# Altium schematic sheet IS12.01-01.603.01.SchDoc
size 750 x 449 mm; SheetNumber: 1; SheetTotal: 1
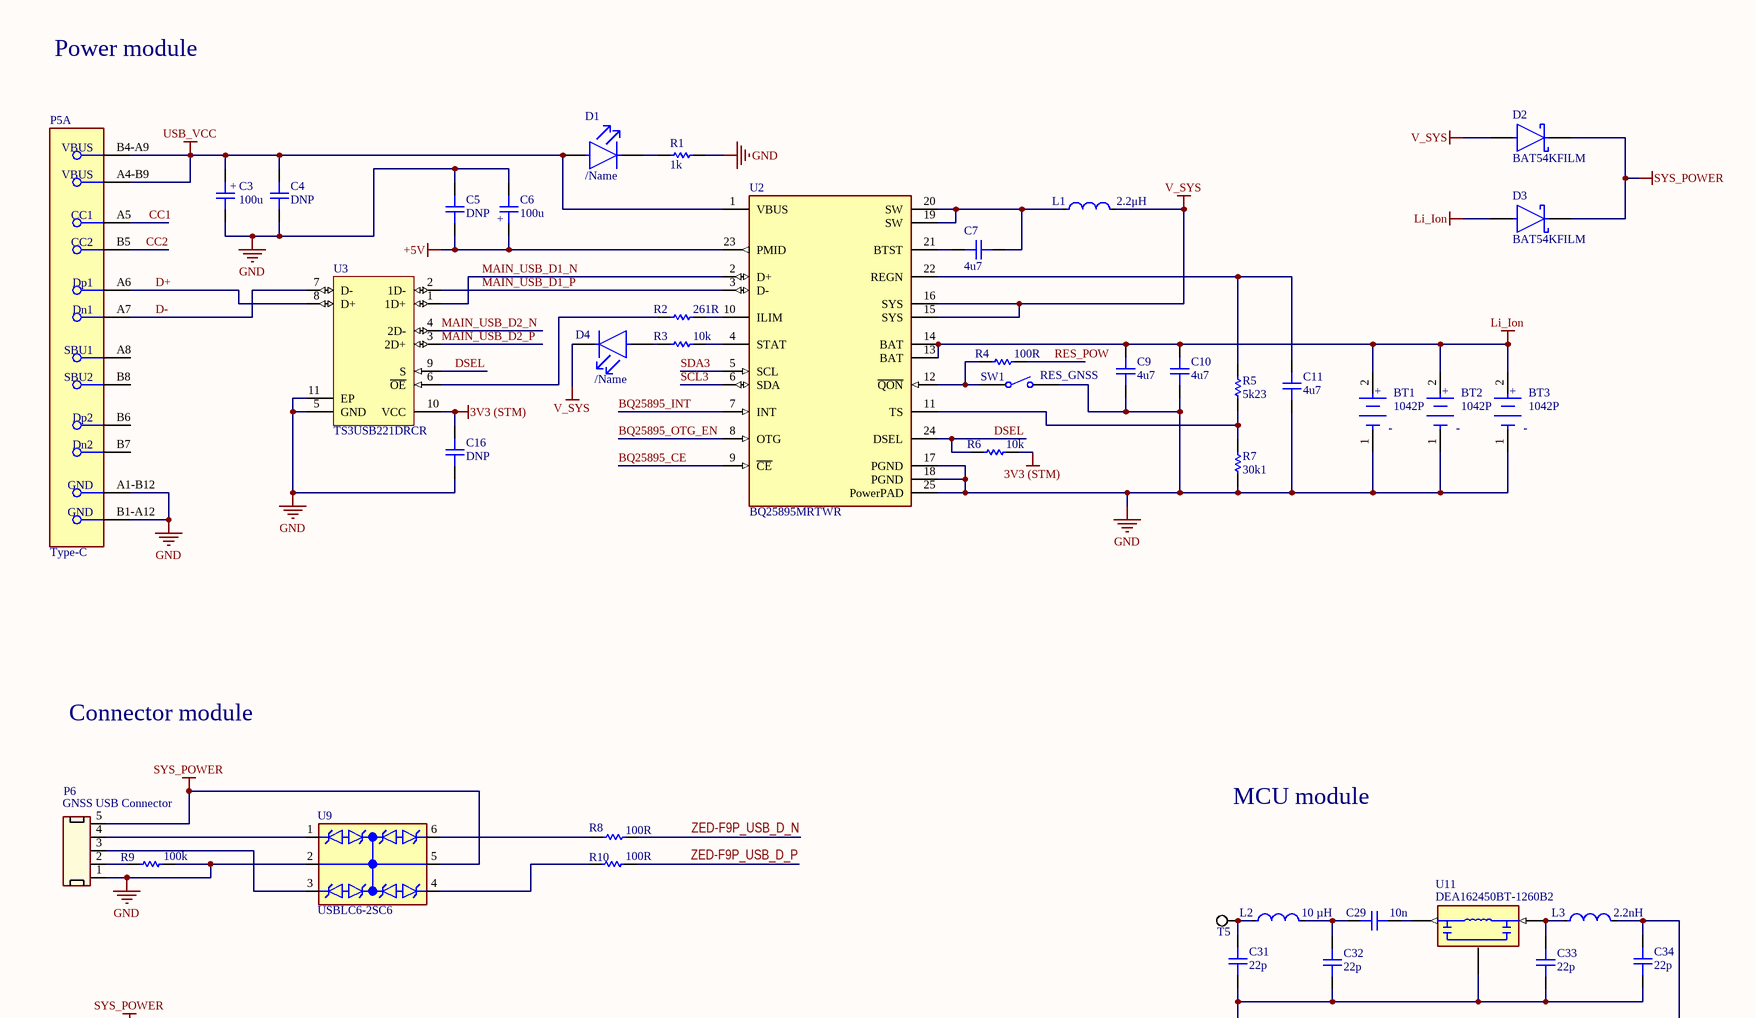
[diagram p0: IS12.01-01.603.01.SchDoc, top left]
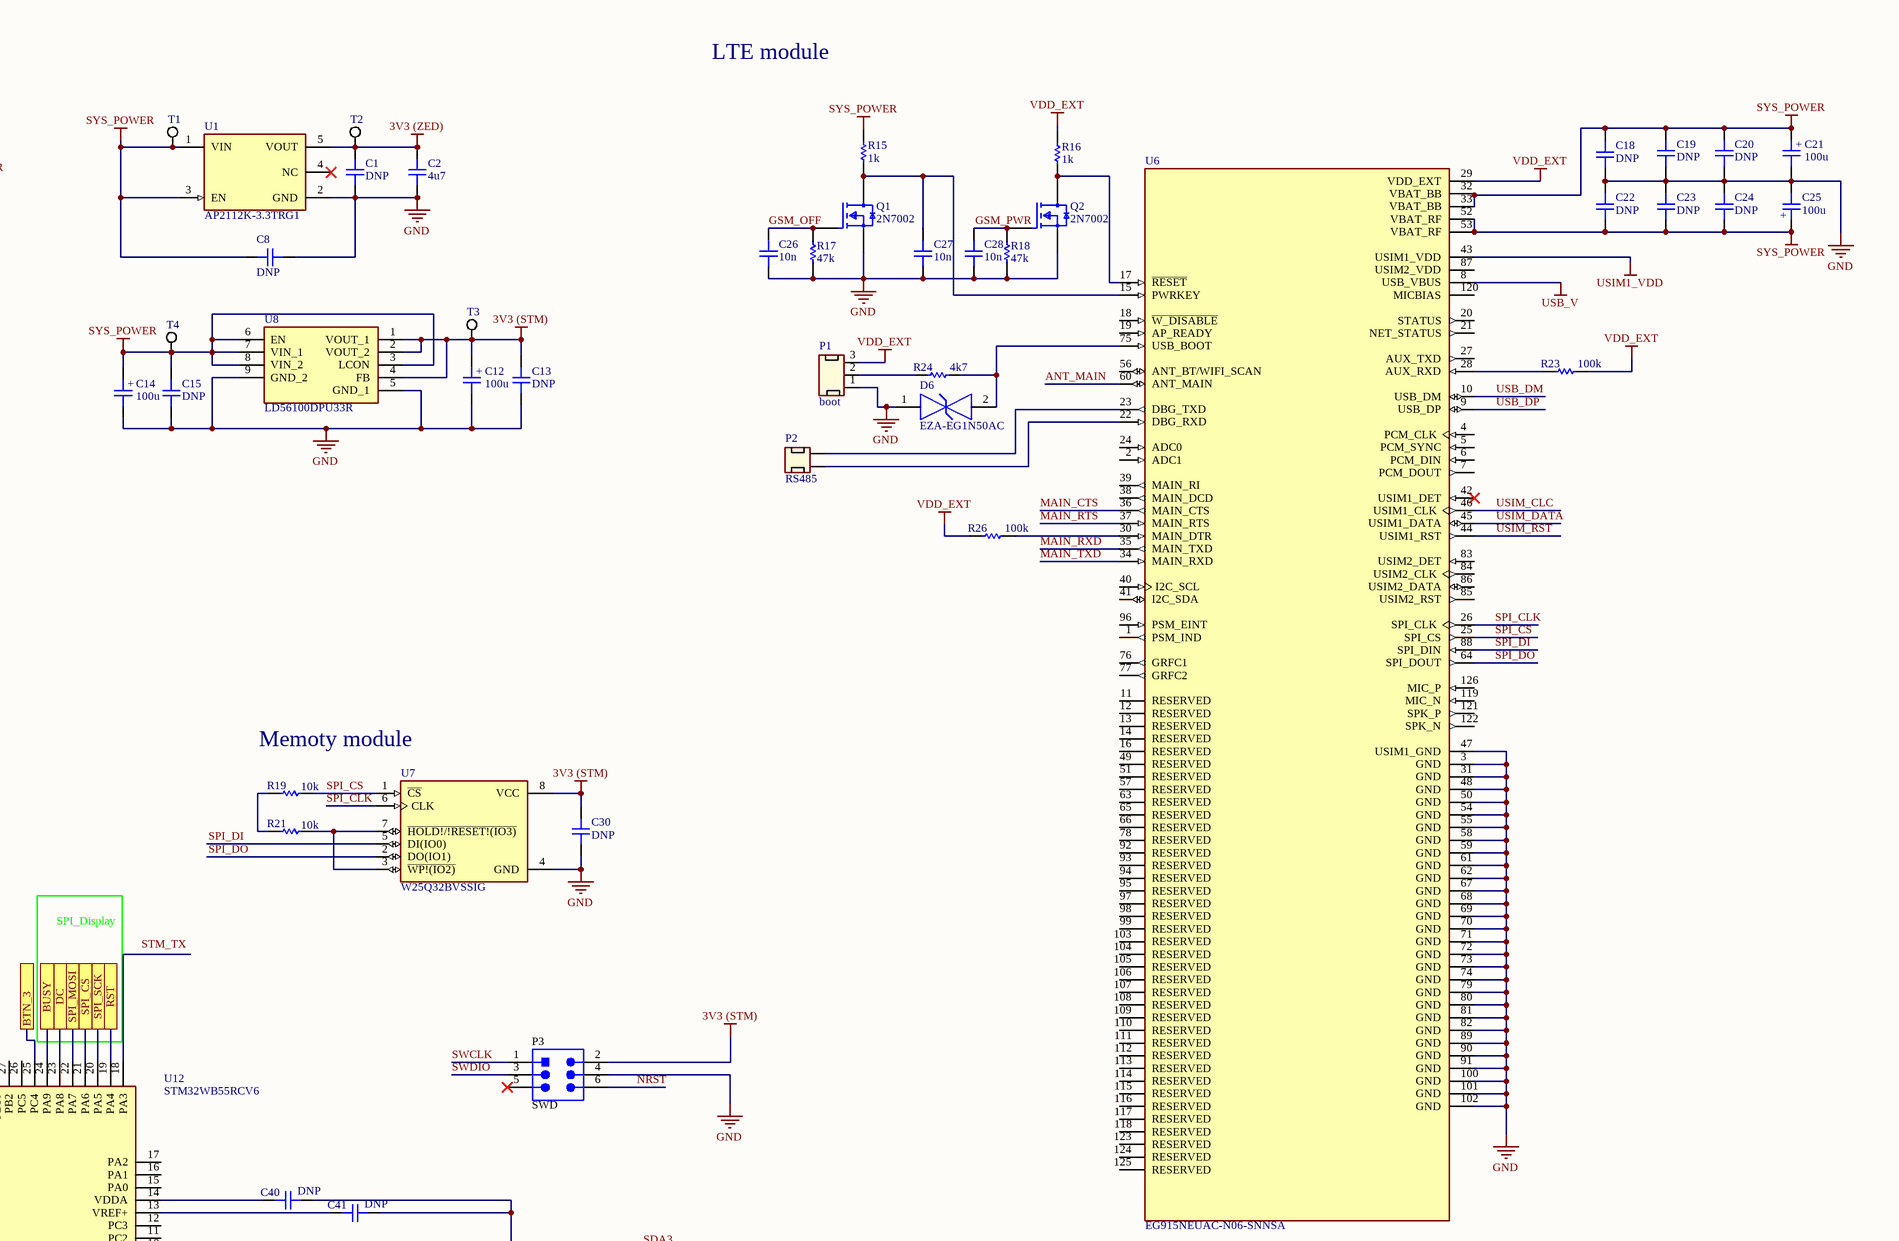
[diagram p1: IS12.01-01.603.01.SchDoc, top right]
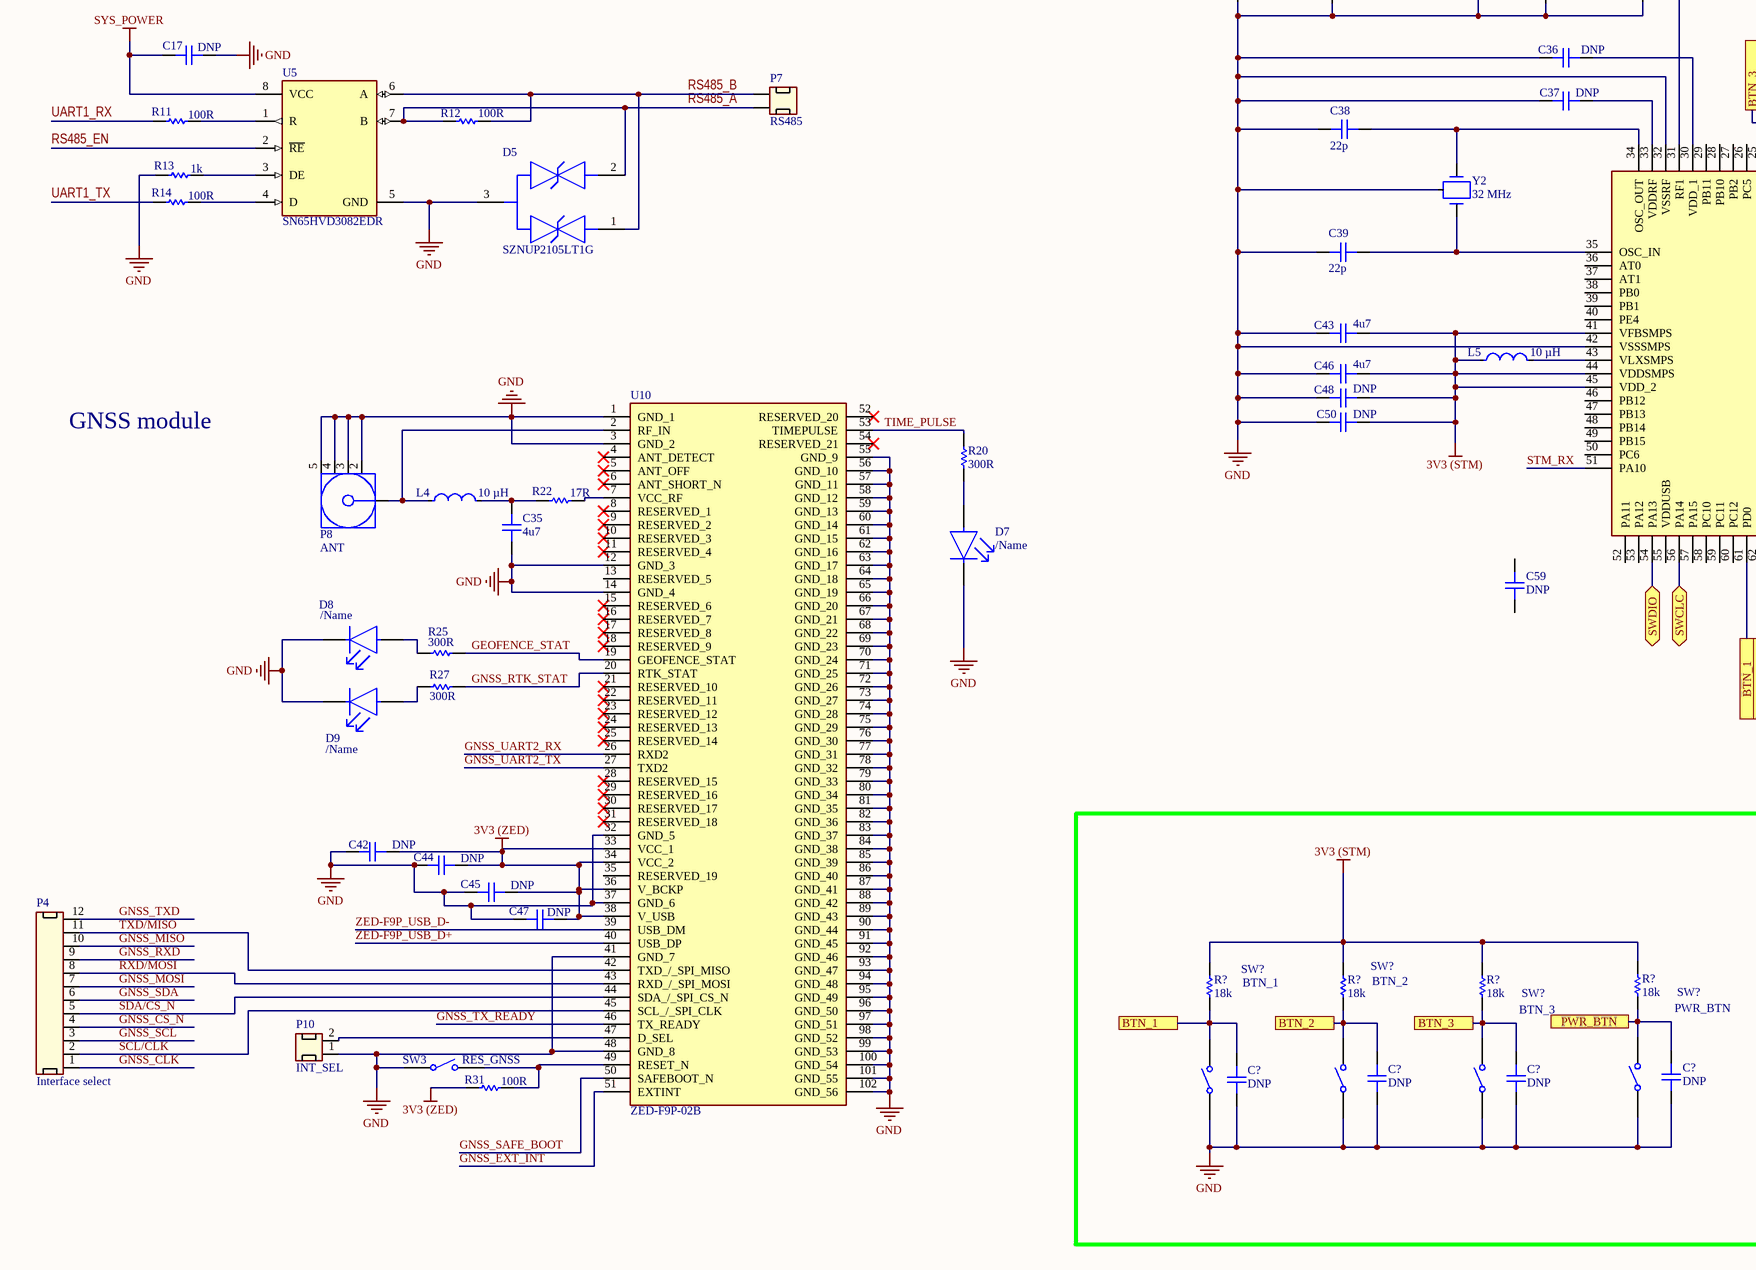
[diagram p2: IS12.01-01.603.01.SchDoc, bottom left]
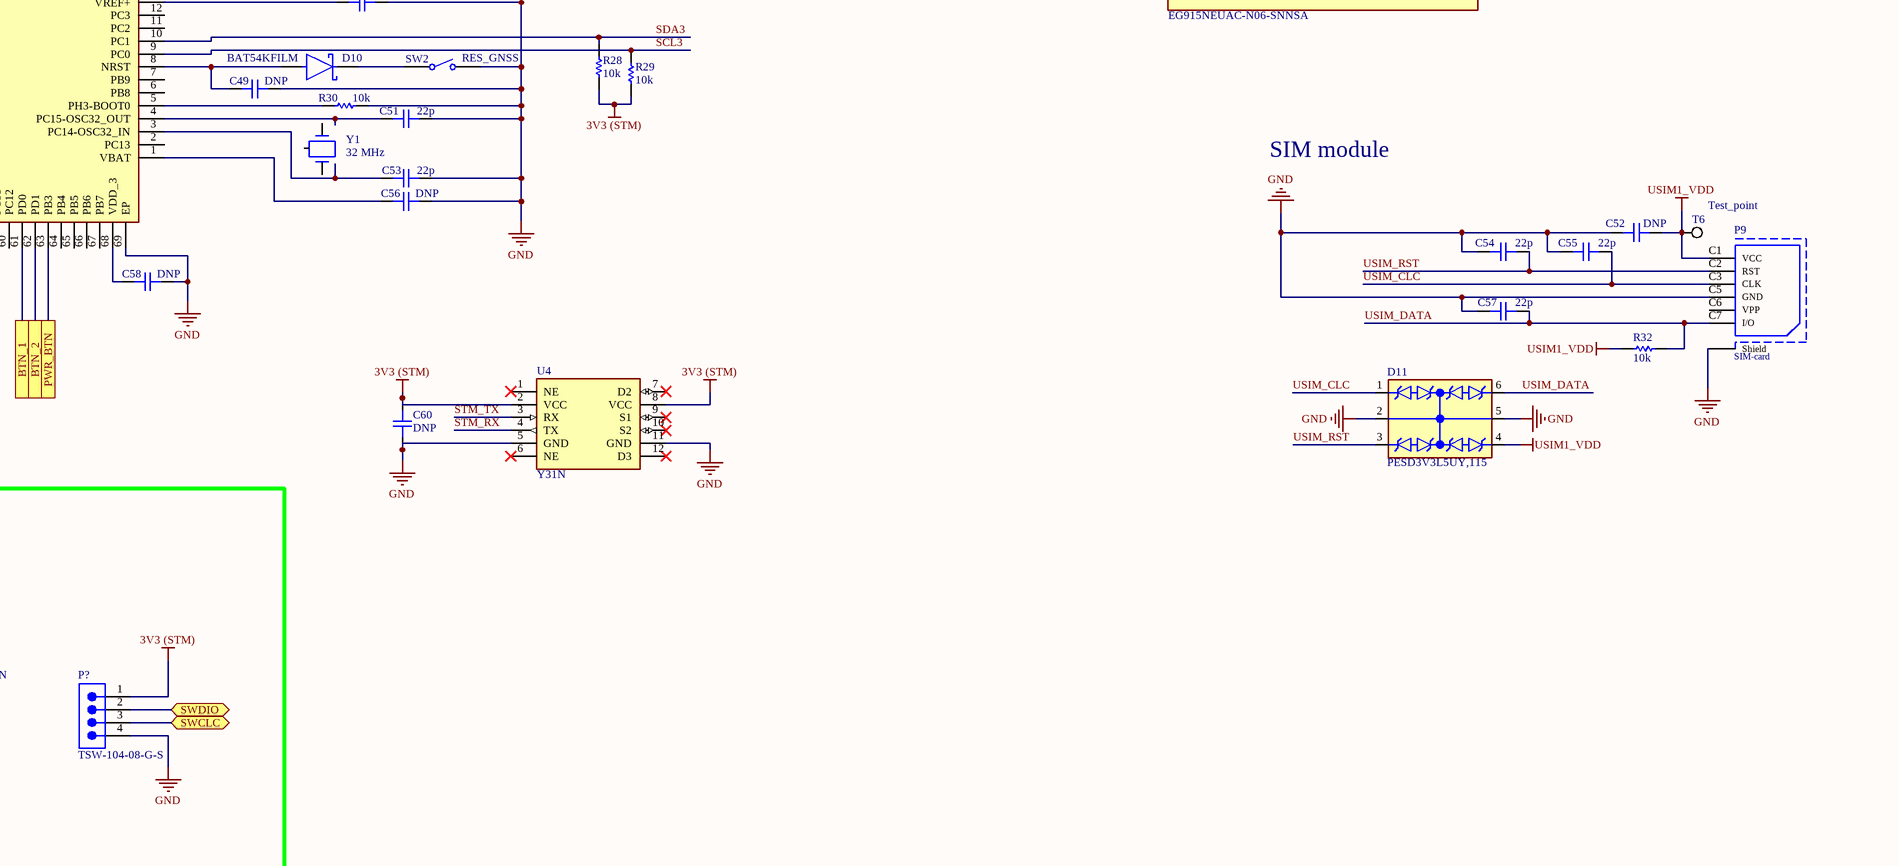
[diagram p3: IS12.01-01.603.01.SchDoc, bottom right]

## Parts
(Parts that share a designator on the sheet are numbered #1, #2 ... from top to bottom, then left to right.)
BT1  1042P  [FP-1042P-MFG]
BT2  1042P  [FP-1042P-MFG]
BT3  1042P  [FP-1042P-MFG]
C1  DNP  [C-0603]
C2  4u7  [C-0603]
C3  100u  [A-TANTAL-A]
C4  DNP  [C-0603]
C5  DNP  [C-0603]
C6  100u  [A-TANTAL-A]
C7  4u7  [C-0603]
C8  DNP  [C-0603]
C9  4u7  [C-0603]
C10  4u7  [C-0603]
C11  4u7  [C-0603]
C12  100u  [A-TANTAL-A]
C13  DNP  [C-0603]
C14  100u  [A-TANTAL-A]
C15  DNP  [C-0603]
C16  DNP  [C-0603]
C17  DNP  [C-0603]
C18  DNP  [C-0603]
C19  DNP  [C-0603]
C20  DNP  [C-0603]
C21  100u  [A-TANTAL-A]
C22  DNP  [C-0603]
C23  DNP  [C-0603]
C24  DNP  [C-0603]
C25  100u  [A-TANTAL-A]
C26  10n  [C-0603]
C27  10n  [C-0603]
C28  10n  [C-0603]
C29  10n  [C-0603]
C30  DNP  [C-0603]
C31  22p  [C-0603]
C32  22p  [C-0603]
C33  22p  [C-0603]
C34  22p  [C-0603]
C35  4u7  [C-0603]
C36  DNP  [C-0603]
C37  DNP  [C-0603]
C38  22p  [C-0603]
C39  22p  [C-0603]
C40  DNP  [C-0603]
C41  DNP  [C-0603]
C42  DNP  [C-0603]
C43  4u7  [C-0603]
C44  DNP  [C-0603]
C45  DNP  [C-0603]
C46  4u7  [C-0603]
C47  DNP  [C-0603]
C48  DNP  [C-0603]
C49  DNP  [C-0603]
C50  DNP  [C-0603]
C51  22p  [C-0603]
C52  DNP  [C-0603]
C53  22p  [C-0603]
C54  22p  [C-0603]
C55  22p  [C-0603]
C56  DNP  [C-0603]
C57  22p  [C-0603]
C58  DNP  [C-0603]
C59  DNP  [C-0603]
C60  DNP  [C-0603]
C?#1  DNP  [C-0603]
C?#2  DNP  [C-0603]
C?#3  DNP  [C-0603]
C?#4  DNP  [C-0603]
D1  /Name  [FP-LTST-C191TBKT-MFG]
D2  BAT54KFILM  [SOD-523]
D3  BAT54KFILM  [SOD-523]
D4  /Name  [FP-LTST-C191TBKT-MFG]
D5  SZNUP2105LT1G  [FP-Micro3-IPC_B]
D6  EZA-EG1N50AC  [FP-EZAEG1-MFG]
D7  /Name  [FP-LTST-C191TBKT-MFG]
D8  /Name  [FP-LTST-C191TBKT-MFG]
D9  /Name  [FP-LTST-C191TBKT-MFG]
D10  BAT54KFILM  [SOD-523]
D11  PESD3V3L5UY,115  [SOT95P280X145-6N]
L1  2.2μH  [FP-NR6028-MFG]
L2  10 µH  [FP-MLZ1608-IPC_A]
L3  2.2nH  [FP-NR6028-MFG]
L4  10 µH  [FP-MLZ1608-IPC_A]
L5  10 µH  [FP-MLZ1608-IPC_A]
P1  boot  [PLS-3]
P2  RS485  [PLS-2]
P3  SWD  [SMTC-TSW-103-08-L-D_V]
P4  Interface select  [PLS-12]
P5  Type-C  [FP-217179-0001-MFG]  (part A of 2)
P6  GNSS USB Connector  [PLS-5]
P7  RS485  [PLS-2]
P8  ANT  [FP-142-0701-201-MFG]
P9  SIM-card  [693043020611]
P10  INT_SEL  [PLS-2]
P?  TSW-104-08-G-S  [SMTC-TSW-104-08-X-S]
Q1  2N7002  [FP-Micro3-IPC_B]
Q2  2N7002  [FP-Micro3-IPC_B]
R1  1k  [R-0603]
R2  261R  [R-0603]
R3  10k  [R-0603]
R4  100R  [R-0603]
R5  5k23  [R-0603]
R6  10k  [R-0603]
R7  30k1  [R-0603]
R8  100R  [R-0603]
R9  100k  [R-0603]
R10  100R  [R-0603]
R11  100R  [R-0603]
R12  100R  [R-0603]
R13  1k  [R-0603]
R14  100R  [R-0603]
R15  1k  [R-0603]
R16  1k  [R-0603]
R17  47k  [R-0603]
R18  47k  [R-0603]
R19  10k  [R-0603]
R20  300R  [R-0603]
R21  10k  [R-0603]
R22  17R  [R-0603]
R23  100k  [R-0603]
R24  4k7  [R-0603]
R25  300R  [R-0603]
R26  100k  [R-0603]
R27  300R  [R-0603]
R28  10k  [R-0603]
R29  10k  [R-0603]
R30  10k  [R-0603]
R31  100R  [R-0603]
R32  10k  [R-0603]
R?#1  18k  [R-0603]
R?#2  18k  [R-0603]
R?#3  18k  [R-0603]
R?#4  18k  [R-0603]
SW1  RES_GNSS  [TECO-FSMSMTR_V]
SW2  RES_GNSS  [TECO-FSMSMTR_V]
SW3  RES_GNSS  [TECO-FSMSMTR_V]
SW?#1  BTN_1  [TECO-FSMSMTR_V]
SW?#2  BTN_2  [TECO-FSMSMTR_V]
SW?#3  BTN_3  [TECO-FSMSMTR_V]
SW?#4  PWR_BTN  [TECO-FSMSMTR_V]
T1  Test_point  [test_point]  (value not drawn)
T2  Test_point  [test_point]  (value not drawn)
T3  Test_point  [test_point]  (value not drawn)
T4  Test_point  [test_point]  (value not drawn)
T5  Test_point  [test_point]  (value not drawn)
T6  Test_point  [test_point]
U1  AP2112K-3.3TRG1  [SOT95P285X140-5N]
U2  BQ25895MRTWR  [QFN50P400X400X80-25N]
U3  TS3USB221DRCR  [SON50P300X300X100-11N]
U4  Y31N  [Y31N]
U5  SN65HVD3082EDR  [FP-SO-8-MFG]
U6  EG915NEUAC-N06-SNNSA  [XCVR_EG915NEUAC-N06-SNNSA]
U7  W25Q32BVSSIG  [SOIC127P790X216-8N]
U8  LD56100DPU33R  [LD56100DPU33R]
U9  USBLC6-2SC6  [SOT95P280X145-6N]
U10  ZED-F9P-02B  [ZEDF9P02B]
U11  DEA162450BT-1260B2  [FIL_DEA162450BT-1288B1]
U12  STM32WB55RCV6  [QFN40P800X800X100-69N-D]
Y1  32 MHz  [SMD-4 (4.5x3.2)]
Y2  32 MHz  [SMD-4 (4.5x3.2)]

## Ports
BTN_1, BTN_2, BTN_3, BUSY, DC, PWR_BTN, RST, SPI_CS, SPI_MOSI, SPI_SCK, SWCLC (bidir), SWDIO (bidir)

## Nets
3V3 (STM): C12.1 C13.1 C16.2 C30.2 C43.2 C46.2 C48.2 C50.2 C60.1 L5.1 P3.2 P?.1 R6.2 R28.1 R29.1 R?#1.2 R?#2.2 R?#3.2 R?#4.2 T3.1 U3.10(VCC) U4.2(VCC) U4.8(VCC) U7.8(VCC) U8.1(VOUT_1) U8.2(VOUT_2) U8.4(FB) U12.41(VFBSMPS) U12.44(VDDSMPS) U12.45(VDD_2)
3V3 (ZED): C1.2 C2.2 C42.1 C44.1 C45.1 C47.1 R31.1 T2.1 U1.5(VOUT) U10.33(VCC_1) U10.34(VCC_2) U10.36(V_BCKP) U10.38(V_USB)
+5V: C5.2 C6.1 U2.23(PMID)
GND: BT1.1(C) BT2.1(C) BT3.1(C) C1.1 C2.1 C3.2 C4.1 C5.1 C6.2 C8.2 C9.1 C10.1 C11.1 C12.2 C13.2 C14.2 C15.2 C16.1 C17.1 C18.1 C19.1 C20.1 C21.2 C22.2 C23.2 C24.2 C25.2 C26.1 C27.1 C28.1 C30.1 C31.2 C32.2 C33.2 C34.2 C35.2 C36.2 C37.1 C38.1 C39.1 C40.2 C41.2 C42.2 C43.1 C44.2 C45.2 C46.1 C47.2 C48.1 C49.2 C50.1 C51.2 C52.2 C53.2 C54.1 C55.1 C56.2 C57.1 C58.2 C60.2 C?#1.2 C?#2.2 C?#3.2 C?#4.2 D5.3 D6.1 D7.1(C) D8.1(C) D9.1(C) D11.2(CC1) D11.5(CC2) P1.1 P3.4 P5.A1-B12(GND) P5.B1-A12(GND) P6.1 P8.2 P8.3 P8.4 P8.5 P9.C5(GND) P9.Shield P10.1 P?.4 Q1.2(S) Q2.2(S) R1.1 R7.1 R9.2 R13.1 R17.1 R18.1 R30.1 SW1.2 SW2.2 SW3.1 SW?#1.1 SW?#2.1 SW?#3.1 SW?#4.1 U1.2(GND) U2.17(PGND) U2.18(PGND) U2.25(PowerPAD) U3.5(GND) U3.11(EP) U4.5(GND) U4.11(GND) U5.5(GND) U6.3(GND) U6.31(GND) U6.47(USIM1_GND) U6.48(GND) U6.50(GND) U6.54(GND) U6.55(GND) U6.58(GND) U6.59(GND) U6.61(GND) U6.62(GND) U6.67(GND) U6.68(GND) U6.69(GND) U6.70(GND) U6.71(GND) U6.72(GND) U6.73(GND) U6.74(GND) U6.79(GND) U6.80(GND) U6.81(GND) U6.82(GND) U6.89(GND) U6.90(GND) U6.91(GND) U6.100(GND) U6.101(GND) U6.102(GND) U7.4(GND) U8.5(GND_1) U8.9(GND_2) U9.2(CC1) U10.1(GND_1) U10.3(GND_2) U10.12(GND_3) U10.14(GND_4) U10.32(GND_5) U10.37(GND_6) U10.41(GND_7) U10.48(GND_8) U10.55(GND_9) U10.56(GND_10) U10.57(GND_11) U10.58(GND_12) U10.59(GND_13) U10.60(GND_14) U10.61(GND_15) U10.62(GND_16) U10.63(GND_17) U10.64(GND_18) U10.65(GND_19) U10.66(GND_20) U10.67(GND_21) U10.68(GND_22) U10.69(GND_23) U10.70(GND_24) U10.71(GND_25) U10.72(GND_26) U10.73(GND_27) U10.74(GND_28) U10.75(GND_29) U10.76(GND_30) U10.77(GND_31) U10.78(GND_32) U10.79(GND_33) U10.80(GND_34) U10.81(GND_35) U10.82(GND_36) U10.83(GND_37) U10.84(GND_38) U10.85(GND_39) U10.86(GND_40) U10.87(GND_41) U10.88(GND_42) U10.89(GND_43) U10.90(GND_44) U10.91(GND_45) U10.92(GND_46) U10.93(GND_47) U10.94(GND_48) U10.95(GND_49) U10.96(GND_50) U10.97(GND_51) U10.98(GND_52) U10.99(GND_53) U10.100(GND_54) U10.101(GND_55) U10.102(GND_56) U11.2(GND) U12.32(VSSRF) U12.42(VSSSMPS) U12.69(EP) Y2.3
Li_Ion: BT1.2(A) BT2.2(A) BT3.2(A) C9.2 C10.2 D3.2(A) U2.13(BAT) U2.14(BAT)
SYS_POWER: C8.1 C14.1 C15.1 C17.2 C18.2 C19.2 C20.2 C21.1 C22.1 C23.1 C24.1 C25.1 D2.1(C) D3.1(C) P6.5 R15.2 T1.1 T4.1 U1.1(VIN) U1.3(EN) U5.8(VCC) U6.32(VBAT_BB) U6.33(VBAT_BB) U6.52(VBAT_RF) U6.53(VBAT_RF) U8.3(LCON) U8.6(EN) U8.7(VIN_1) U8.8(VIN_2) U9.5(CC2)
USB_V: U6.8(USB_VBUS)
USB_VCC: C3.1 C4.2 D1.2(A) P5.A4-B9(VBUS) P5.B4-A9(VBUS) U2.1(VBUS)
USIM1_VDD: C52.1 D11.4(C3) P9.C1(VCC) R32.1 T6.1 U6.43(USIM1_VDD)
V_SYS: D2.2(A) D4.1(C) L1.2 U2.15(SYS) U2.16(SYS)
VDD_EXT: P1.3 R16.2 R23.1 R26.2 U6.29(VDD_EXT)
ANT_MAIN: U6.60(ANT_MAIN)
BQ25895_CE: U2.9(~{CE})
BQ25895_INT: U2.7(INT)
BQ25895_OTG_EN: U2.8(OTG)
BTN_1: C?#1.1 R?#1.1 SW?#1.2 U12.61(PD0) ; port BTN_1
BTN_2: C?#2.1 R?#2.1 SW?#2.2 U12.62(PD1) ; port BTN_2
BTN_3: C?#3.1 R?#3.1 SW?#3.2 U12.25(PC4) ; port BTN_3
BUSY: U12.24(PA9) ; port BUSY
CC1: P5.A5(CC1)
CC2: P5.B5(CC2)
D+: P5.A6(Dp1) U3.8(D+)
D-: P5.A7(Dn1) U3.7(D-)
DC: U12.23(PA8) ; port DC
DSEL: R6.1 U2.24(DSEL) U3.9(S)
GEOFENCE_STAT: R25.2 U10.19(GEOFENCE_STAT)
GNSS_CLK: P4.1
GNSS_CS_N: P4.4
GNSS_EXT_INT: U10.51(EXTINT)
GNSS_MISO: P4.10
GNSS_MOSI: P4.7
GNSS_RTK_STAT: R27.2 U10.20(RTK_STAT)
GNSS_RXD: P4.9
GNSS_SAFE_BOOT: U10.50(SAFEBOOT_N)
GNSS_SCL: P4.3
GNSS_SDA: P4.6
GNSS_TX_READY: U10.46(TX_READY)
GNSS_TXD: P4.12
GNSS_UART2_RX: U10.26(RXD2)
GNSS_UART2_TX: U10.27(TXD2)
GSM_OFF: C26.2 Q1.1(G) R17.2
GSM_PWR: C28.2 Q2.1(G) R18.2
MAIN_CTS: U6.36(MAIN_CTS)
MAIN_RTS: U6.37(MAIN_RTS)
MAIN_RXD: U6.35(MAIN_TXD)
MAIN_TXD: U6.34(MAIN_RXD)
MAIN_USB_D1_N: U2.2(D+) U3.1(1D+)
MAIN_USB_D1_P: U2.3(D-) U3.2(1D-)
MAIN_USB_D2_N: U3.4(2D-)
MAIN_USB_D2_P: U3.3(2D+)
NRST: P3.6
PWR_BTN: C?#4.1 R?#4.1 SW?#4.2 U12.63(PB3) ; port PWR_BTN
RES_POW: R4.2
RS485_A: D5.2 P7.2 R12.1 U5.7(B)
RS485_B: D5.1 P7.1 R12.2 U5.6(A)
RS485_EN: U5.2(~{RE})
RST: U12.19(PA4) ; port RST
RXD/MOSI: P4.8 U10.43(RXD_/_SPI_MOSI)
SCL3: R29.2 U2.6(SDA) U12.9(PC0)
SCL/CLK: P4.2 U10.45(SCL_/_SPI_CLK)
SDA3: R28.2 U2.5(SCL) U12.10(PC1)
SDA/CS_N: P4.5 U10.44(SDA_/_SPI_CS_N)
SPI_CLK: U6.26(SPI_CLK) U7.6(CLK)
SPI_CS: R19.2 U6.25(SPI_CS) U7.1(~{CS})
SPI_CS: U12.21(PA6) ; port SPI_CS  [a separate net that carries the same name]
SPI_DI: U6.88(SPI_DIN) U7.5(DI(IO0))
SPI_DO: U6.64(SPI_DOUT) U7.2(DO(IO1))
SPI_MOSI: U12.22(PA7) ; port SPI_MOSI
SPI_SCK: U12.20(PA5) ; port SPI_SCK
STM_RX: U4.4(TX) U12.51(PA10)
STM_TX: U4.3(RX)
SWCLC: P?.3 U12.56(PA14) ; port SWCLC
SWCLK: P3.1
SWDIO: P3.3
SWDIO: P?.2 U12.54(PA13) ; port SWDIO  [a separate net that carries the same name]
TIME_PULSE: R20.2 U10.53(TIMEPULSE)
TXD/MISO: P4.11 U10.42(TXD_/_SPI_MISO)
UART1_RX: R11.1
UART1_TX: R14.1
USB_DM: U6.10(USB_DM)
USB_DP: U6.9(USB_DP)
USIM_CLC: C55.2 D11.1(C1) P9.C3(CLK) U6.46(USIM1_CLK)
USIM_DATA: C57.2 D11.6(C4) P9.C7(I/O) R32.2 U6.45(USIM1_DATA)
USIM_RST: C54.2 D11.3(C2) P9.C2(RST) U6.44(USIM1_RST)
ZED-F9P_USB_D+: U10.40(USB_DP)
ZED-F9P_USB_D-: U10.39(USB_DM)
ZED-F9P_USB_D_N: R8.2
ZED-F9P_USB_D_P: R10.2
NetC7_1: C7.1 L1.1 U2.19(SW) U2.20(SW)
NetC7_2: C7.2 U2.21(BTST)
NetC11_2: C11.2 R5.1 U2.22(REGN)
NetC27_2: C27.2 Q1.3(D) R15.1 U6.15(PWRKEY)
NetC29_1: C29.1 U11.3(OUT)
NetC29_2: C29.2 C32.1 L2.2
NetC31_1: C31.1 L2.1 T5.1
NetC33_1: C33.1 L3.1 U11.1(IN)
NetC34_1: C34.1 L3.2 U12.31(RF1)
NetC35_1: C35.1 L4.2 R22.1
NetC36_1: C36.1 U12.30(VDD_1)
NetC37_2: C37.2 U12.33(VDDRF)
NetC38_2: C38.2 U12.34(OSC_OUT) Y2.2
NetC39_2: C39.2 U12.35(OSC_IN) Y2.1
NetC40_1: C40.1 U12.14(VDDA)
NetC41_1: C41.1 U12.13(VREF+)
NetC49_1: C49.1 D10.2(A) U12.8(NRST)
NetC51_1: C51.1 U12.4(PC15-OSC32_OUT)
NetC53_1: C53.1 U12.3(PC14-OSC32_IN)
NetC56_1: C56.1 U12.1(VBAT)
NetC58_1: C58.1 U12.68(VDD_3)
NetD1_1: D1.1(C) R1.2
NetD4_2: D4.2(A) R3.1
NetD6_2: D6.2 R24.1 U6.75(USB_BOOT)
NetD7_2: D7.2(A) R20.1
NetD8_2: D8.2(A) R25.1
NetD9_2: D9.2(A) R27.1
NetD10_1: D10.1(C) SW2.1
NetL4_1: L4.1 P8.1 U10.2(RF_IN)
NetL5_2: L5.2 U12.43(VLXSMPS)
NetP1_2: P1.2 R24.2
NetP2_1: P2.1 U6.22(DBG_RXD)
NetP2_2: P2.2 U6.23(DBG_TXD)
NetP6_2: P6.2 R9.1
NetP6_3: P6.3 U9.3(C2)
NetP6_4: P6.4 U9.1(C1)
NetP10_2: P10.2 U10.47(D_SEL)
NetQ2_3: Q2.3(D) R16.1 U6.17(~{RESET})
NetR2_1: R2.1 U3.6(~{OE})
NetR2_2: R2.2 U2.10(ILIM)
NetR3_2: R3.2 U2.4(STAT)
NetR4_1: R4.1 SW1.1 U2.12(~{QON})
NetR5_2: R5.2 R7.2 U2.11(TS)
NetR8_1: R8.1 U9.6(C4)
NetR10_1: R10.1 U9.4(C3)
NetR11_2: R11.2 U5.1(R)
NetR13_2: R13.2 U5.3(DE)
NetR14_2: R14.2 U5.4(D)
NetR19_1: R19.1 R21.1
NetR21_2: R21.2 U7.3(~{WP!(IO2)}) U7.7(~{HOLD!/!RESET!(IO3)})
NetR22_2: R22.2 U10.7(VCC_RF)
NetR23_2: R23.2 U6.28(AUX_RXD)
NetR26_1: R26.1 U6.30(MAIN_DTR)
NetR30_2: R30.2 U12.5(PH3-BOOT0)
NetR31_2: R31.2 SW3.2 U10.49(RESET_N)

Not connected (* = marked no-connect by the designer): C59 1 2; P3 5*; P5 A8(SBU1) B6(Dp2) B7(Dn2) B8(SBU2); P9 C6(VPP); U1 4(NC)*; U4 1(NE)* 6(NE)* 7(D2)* 9(S1)* 10(S2)* 12(D3)*; U6 1(PSM_IND) 2(ADC1) 4(PCM_CLK) 5(PCM_SYNC) 6(PCM_DIN) 7(PCM_DOUT) 11(RESERVED) 12(RESERVED) 13(RESERVED) 14(RESERVED) 16(RESERVED) 18(~{W_DISABLE}) 19(AP_READY) 20(STATUS) 21(NET_STATUS) 24(ADC0) 27(AUX_TXD) 38(MAIN_DCD) 39(MAIN_RI) 40(I2C_SCL) 41(I2C_SDA) 42(USIM1_DET)* 49(RESERVED) 51(RESERVED) 56(ANT_BT/WIFI_SCAN) 57(RESERVED) 63(RESERVED) 65(RESERVED) 66(RESERVED) 76(GRFC1) 77(GRFC2) 78(RESERVED) 83(USIM2_DET) 84(USIM2_CLK) 85(USIM2_RST) 86(USIM2_DATA) 87(USIM2_VDD) 92(RESERVED) 93(RESERVED) 94(RESERVED) 95(RESERVED) 96(PSM_EINT) 97(RESERVED) 98(RESERVED) 99(RESERVED) 103(RESERVED) 104(RESERVED) 105(RESERVED) 106(RESERVED) 107(RESERVED) 108(RESERVED) 109(RESERVED) 110(RESERVED) 111(RESERVED) 112(RESERVED) 113(RESERVED) 114(RESERVED) 115(RESERVED) 116(RESERVED) 117(RESERVED) 118(RESERVED) 119(MIC_N) 120(MICBIAS) 121(SPK_P) 122(SPK_N) 123(RESERVED) 124(RESERVED) 125(RESERVED) 126(MIC_P); U10 4(ANT_DETECT)* 5(ANT_OFF)* 6(ANT_SHORT_N)* 8(RESERVED_1)* 9(RESERVED_2)* 10(RESERVED_3)* 11(RESERVED_4)* 13(RESERVED_5) 15(RESERVED_6)* 16(RESERVED_7)* 17(RESERVED_8)* 18(RESERVED_9)* 21(RESERVED_10)* 22(RESERVED_11)* 23(RESERVED_12)* 24(RESERVED_13)* 25(RESERVED_14)* 28(RESERVED_15)* 29(RESERVED_16)* 30(RESERVED_17)* 31(RESERVED_18)* 35(RESERVED_19) 52(RESERVED_20)* 54(RESERVED_21)*; U12 2(PC13) 6(PB8) 7(PB9) 11(PC2) 12(PC3) 15(PA0) 16(PA1) 17(PA2) 18(PA3) 26(PC5) 27(PB2) 28(PB10) 29(PB11) 36(AT0) 37(AT1) 38(PB0) 39(PB1) 40(PE4) 46(PB12) 47(PB13) 48(PB14) 49(PB15) 50(PC6) 52(PA11) 53(PA12) 55(VDDUSB) 57(PA15) 58(PC10) 59(PC11) 60(PC12) 64(PB4) 65(PB5) 66(PB6) 67(PB7); Y1 1 2 3

## Notes on the sheet
- Power module
- LTE module
- Connector module
- MCU module
- Memoty module
- SPI_Display
- GNSS module
- SIM module
- Labels drawn without touching a wire or pin: STM_TX
- (in symbol CMP-19636-000019-1) +; -
- (in symbol TAJD107M010RNJ) +

## Library data of the parts
BT1-BT3 = CMP-19636-000019-1: BATT HOLDER 18650 1 CELL SMD; Manufacturer: Keystone Electronics; Number of Cells: 1; Max Operating Temperature: 145°C; Termination: SMD/SMT; Mount: Surface Mount; Min Operating Temperature: -50°C; Package Quantity: 200; Packaging: Tray; Lead Free: Lead Free; Manufacturer Part Number: 1042P
C1 C4 C5 C8 C13 C15-C20 C22-C24 C30 C36 C37 C40-C42 C44 C45 C47-C50 C52 C56 C58-C60 C?#1-C?#4 = C0603: CAP CER DNP 16V X8R 0603; Supplier 1: Digi-Key; Supplier Part Number 1: 1276-2368-1-ND
C2 C7 C9-C11 C35 C43 C46 = CL10A475KO8NNNC: CAP CER 4.7UF 16V X5R 0603; Supplier 1: Digi-Key; Supplier Part Number 1: 1276-2368-1-ND
C3 C6 C12 C14 C21 C25 = TAJD107M010RNJ: CAP TANT 100UF 20% 10V 2917; Supplier 1: Digi-Key; Supplier Part Number 1: 399-18160-1-ND
C26-C29 = CL10B103KB8NNNC_1: CAP CER 10000PF 50V X7R 0603; Supplier 1: Digi-Key; Supplier Part Number 1: 1276-2368-1-ND
C31-C34 C38 C39 C51 C53-C55 C57 = C0603C220J5GAC7867: CAP CER 22PF 50V C0G/NP0 0603; Supplier 1: Digi-Key; Supplier Part Number 1: 1276-2368-1-ND
D1 D4 D7-D9 = LTST-C190GKT: LED GREEN CLEAR CHIP SMD; Manufacturer: Vishay Lite-On; Manufacturer Part Number: LTST-C191TBKT; Lens Color: Colorless; Dominant Wavelength: 475nm; Forward Current: 20mA; Wavelength: 468nm; Viewing Angle: 130°; Power Dissipation: 76mW; Illumination Color: Blue; Luminous Intensity: 180mcd; Reverse Voltage: 5V; Number of Elements: 1; Lens Style: Diffused; Forward Voltage: 3.8V; Max Power Dissipation: 75mW; Case Code (Metric): 1608; Packaging: Tape and Reel; Case/Package: 0603; Depth: 1.6mm; Mount: Surface Mount; Lead Free: Lead Free; Min Operating Temperature: -20°C; Lens Transparency: Clear; Height: 0.55mm; Test Current: 20mA; Case Code (Imperial): 0603; Max Operating Temperature: 80°C; Number of Pins: 2; Length: 0.8mm; Radiation Hardening: No; Package Quantity: 1; Number of LEDs: 1; Width: 0.8mm; Color: Blue
D2 D3 D10 = BAT54KFILM: DIODE SCHOTTKY 40V 300MA SOD523; Manufacturer: STMicroelectronics; Capacitance: 7pF; Value: 7pF; Max Surge Forward Current: 1.25A; Peak Reverse Current: 1uA; Max Junction Temp: +150°C; Device Class L2: Diodes; Temperature Range Low: -40°C; Category: Diode; Manufacturer Part Number: BAT54KFILM; Digikey Description: DIODE SCHOTTKY 40V 300MA SOD523; Device Class L3: Schottky Diodes; Automotive: No; Height: 0.7mm; Octopart: https://octopart.com/bat54kfilm-stmicroelectronics-39618022; ComponentLink2Description: Datasheet; Temperature Range High: +150°C; Device Class L1: Discrete Semiconductors; Max Repetitive Reverse Voltage: 40V; RoHS: TRUE; Temperature: -40°C to +150°C; ComponentLink2URL: https://www.st.com/content/ccc/resource/technical/document/datasheet/07/50/54/f2/0d/ba/4a/79/CD00001322.pdf/files/CD00001322.pdf/jcr:content/translations/en.CD00001322.pdf; Lead Free: Yes; Forward Current: 300mA; Package: SOD-523; Mouser Description: Schottky Diodes & Rectifiers schottky diode
D5 = SZNUP2105LT1G: TVS DIODE 24VWM 44VC SOT23-3; Manufacturer: ON Semiconductor; Reverse Standoff Voltage: 24V; Capacitance: 30pF; Max Junction Temp: +150°C; Breakdown Voltage: 26.2V; Number Of Channels: 2; Automotive Grade: Grade 0; Standoff Height: 0.01mm; Peak Pulse Current: 8A; Value: 30pF; Direction: Bidirectional; Peak Pulse Power: 350W; Clamping Voltage: 44V; Octopart: https://octopart.com/sznup2105lt1g-on+semiconductor-22134626; Digikey Description: TVS DIODE 24V 44V SOT23-3; RoHS: TRUE; Manufacturer Part Number: SZNUP2105LT1G; Height: 1.11mm; Automotive: Yes; ComponentLink2URL: https://www.onsemi.com/pub/Collateral/NUP2105L-D.PDF; Device Class L3: unset; Package: 318-08; Lead Free: Yes; Device Class L2: TVS Diodes; Footprint Url: https://www.onsemi.com/pub/Collateral/318-08.PDF; Temperature Range Low: -55°C; Device Class L1: Circuit Protection; Temperature: -55°C to +150°C; Temperature Range High: +150°C; Category: Diode; ComponentLink2Description: Datasheet
D6 = EZA-EG1N50AC: ESD SUPPRESSOR 0201; Manufacturer: Panasonic; Varistor Voltage: 30V; Number of Circuits: 1; Series: -; Case Code (Imperial): 0201; Packaging: Cut Tape; Mount: Surface Mount; Case/Package: 0201; Case Code (Metric): 0603; Manufacturer Part Number: EZA-EG1N50AC
D11 = PESD3V3L5UY,115: TVS DIODE 3.3VWM 12VC 6TSSOP; MP: ESDA6V1BC6; MF: STMicroelectronics; Check_prices: https://www.snapeda.com/parts/ESDA6V1BC6/STMicroelectronics/view-part/?ref=eda; Price: None; Purchase-URL: https://pricing.snapeda.com/search/part/ESDA6V1BC6/?ref=eda; SnapEDA_Link: https://www.snapeda.com/parts/ESDA6V1BC6/STMicroelectronics/view-part/?ref=snap; Availability: In Stock; Package: SOT-23-6 STMicroelectronics; Value: *
L1 = CMP-14484-000415-1: SMD Power Inductors 2.2uH ±30% 3.7A 26mΩ; Manufacturer: Taiyo Yuden; Manufacturer Part Number: NR6028T2R2N; Core Material: Ferrite; Test Frequency: 100kHz; DC Resistance (DCR): 26mR; Saturation Current: 4.2A; Self Resonant Frequency: 68MHz; Shielding: Shielded; Width: 0.236inch; Package Quantity: 2000; Case/Package: 2424; Length: 0.236inch; Height: 2.8mm; Height - Seated (Max): 0.11inch; RMS Current (Irms): 3.7A; Current Rating: 3.7A; Termination: SMD/SMT; Tolerance: 30%; Inductance Tolerance: 30%; Depth: 6.2mm; Halogen Free: Halogen Free; Mount: Surface Mount; Series: NR; Max DC Current: 3.7A; Number of Pins: 2; Min Operating Temperature: -25°C; Inductance: 2.2uH; Max Operating Temperature: 120°C; Packaging: Tape and Reel; Radiation Hardening: No; RoHS Compliant: Yes; Resistor Type: Wirewound
L2 L4 L5 = MLZ1608M100WT000: FIXED IND 10UH 250MA 1.05OHM SMD; Manufacturer: Taiyo Yuden; Manufacturer Part Number: LBMF1608T100M; Current Rating: 80mA; Shielding: Unshielded; Self Resonant Frequency: 32MHz; Core Material: Ferrite; Tolerance: 20%; DC Resistance (DCR): 360mR; Test Frequency: 2.52MHz; Inductance: 10uH; Min Operating Temperature: -40°C; Halogen Free: Halogen Free; Termination: SMD/SMT; Height - Seated (Max): 0.039inch; Case Code (Metric): 1608; DC Current: 80mA; Resistor Type: Wirewound; Lead Free: Lead Free; Radiation Hardening: No; Packaging: Tape and Reel; Length: 0.063inch; Lead Pitch: 0.7mm; Series: LB; Max Operating Temperature: 105°C; Weight: 7.1E-05oz; Height: 0.35mm; Military Standard: Not; Case Code (Imperial): 0603; Case/Package: 0603; Depth: 0.9mm; RoHS Compliant: Yes; Mount: Surface Mount; Width: 0.031inch; Max DC Current: 80mA
L3 = CMP-14484-000415-1: SMD Power Inductors 2.2uH ±30% 3.7A 26mΩ; Manufacturer: Taiyo Yuden; Manufacturer Part Number: NR6028T2R2N; Shielding: Shielded; Self Resonant Frequency: 68MHz; Core Material: Ferrite; DC Resistance (DCR): 26mR; Test Frequency: 100kHz; Saturation Current: 4.2A; Current Rating: 3.7A; Inductance: 2.2uH; Min Operating Temperature: -25°C; Halogen Free: Halogen Free; Termination: SMD/SMT; Height - Seated (Max): 0.11inch; Resistor Type: Wirewound; Radiation Hardening: No; Packaging: Tape and Reel; Length: 0.236inch; Series: NR; Max Operating Temperature: 120°C; Tolerance: 30%; Height: 2.8mm; Case/Package: 2424; Depth: 6.2mm; RoHS Compliant: Yes; Mount: Surface Mount; Width: 0.236inch; Max DC Current: 3.7A; Package Quantity: 2000; RMS Current (Irms): 3.7A; Inductance Tolerance: 30%; Number of Pins: 2
P1 = PLS-3: PLS-3, вилка штыревая 2.54мм
P2 P7 = PLS-2: PLS-2, вилка штыревая 2.54мм
P3 = TSW-103-08-L-D: CONN HEADER VERT 6POS 2.54MM; Manufacturer: Samtec; DatasheetVersion: 04/2012; ComponentLink3URL: http://suddendocs.samtec.com/prints/tsw-xxx-xx-x-x-xx-xxx-footprint.pdf; PackageReference: TSW-103-08-L-D; Mounting Technology: Through Hole; Min Operating Temperature: -55 degC; ComponentLink2Description: Datasheet; Lead Pitch: 2.54 mm; ComponentLink1Description: Manufacturer URL; Mount: Through Hole; ComponentLink1URL: http://www.samtec.com/; ComponentLink3Description: Package Specification; Max Operating Temperature: 125 degC; PackageDescription: Male Header, Pitch 2.54 mm, 2 x 3 Position, Height 8.38 mm, Tail Length 5.08 mm; ComponentLink2URL: https://datasheet.ciiva.com/25618/0900766b81154476-25618436.pdf; RoHSCompliant: true; Manufacturer Part Number: TSW-103-08-L-D
P4 = PLS-12: PLS-12, вилка штыревая 2.54мм
P5 = USB4105-GF-A: CONN RCP USB2.0 TYP C 24P SMD RA; Manufacturer: Molex; Manufacturer Part Number: 217179-0001
P6 = PLS-5: PLS-5, вилка штыревая 2.54мм
P8 = 142-0701-201: CONN SMA JACK STR 50 OHM PCB; Manufacturer: TE Connectivity; Manufacturer Part Number: 5-1814832-1; Connector Mounting: PCBMount; Connector Body Style: StraightJack; Impedance: 50ohm; Coaxial Termination: Solder; SVHC: NoSVHC(15-Jun-2015); Frequency Max: 3GHz; Product Range: ZDCSeries; Connector Type: SMACoaxial; Datasheet Version: Rev. B1, 03/2011; Package Reference: 5-1814832-1; Package Description: SMA Connector, Pitch 5.08 mm, 1 Position, Height 9.5 mm, Tail Length 4 mm; Contact Plating: GoldPlatedContacts; Coaxial Cable Types: -; Contact Material: BerylliumCopper; Manufacturer URL: http://www.te.com/; Datasheet URL: http://www.onlinecomponents.com/productFiles/mf-AMP/eng_cd_1814832_a.pdf
P9 = 693043020611: CONN SMART CARD PUSH-PULL; Manufacturer: Wurth Electronics; Rated Current: 1A; Working Voltage: 15VAC; Withstanding Voltage: 500VAC; Datasheet URL: https://katalog.we-online.de/em/datasheet/693043020611.pdf; Operating Temperature: -25to85degC; Packaging: TapeandReel; Package Reference: 693043020611; Part Number: 693043020611; Publisher: WurthElektronik; Manufacturer URL: http://www.we-online.de; Mounting Technology: SMT; Manufacturer Part Number: 693043020611
P10 = PLS-2_1: PLS-2, вилка штыревая 2.54мм
P? = CMP-1024-00357-1: 0.025" SQ Post Header, Through-hole, Vertical, -55 to 125 degC, 2.54 mm Pitch, 4-Pin, Male, RoHS; Manufacturer: Samtec; Pitch: 2.54 mm; RoHS: True; ComponentLink3URL: http://www.samtec.com/documents/webfiles/cpdf/TSW-XXX-XX-XXX-X-XX-XXX-MKT.pdf; Mounting Technology: Through-hole; ComponentLink2URL: http://www.samtec.com/documents/webfiles/pdf/TSW_TH.PDF; ComponentLink1URL: http://www.samtec.com; ComponentLink3Description: Package Specification; PackageVersion: DM, 8/1988; ComponentLink2Description: Datasheet; PackageReference: TSW-104-08-X-S; PackageDescription: .025[0.64] SQ. Post Terminal Strip Assembly; PartNumber: TSW-104-08-G-S; ComponentLink1Description: Manufacturer URL; Temperature Range: -55 to 125 degC; DatasheetVersion: F-214; Orientation: Vertical
Q1 Q2 = 2N7002: MOSFET SOT23 N 60V 5OHM 150C; Manufacturer: Infineon; Manufacturer Part Number: IRLML2402TRPBF; Max Power Dissipation: 540mW; Gate to Source Voltage (Vgs): 12V; Drain to Source Resistance: 350mR; Rise Time: 9.5ns; Threshold Voltage: 700mV; Drain to Source Voltage (Vdss): 20V; Continuous Drain Current (ID): 1.2A; Turn-On Delay Time: 2.5ns; Input Capacitance: 110pF; Element Configuration: Single; Power Dissipation: 540W; Turn-Off Delay Time: 9.7ns; Rds On Max: 250mR; REACH SVHC: No SVHC; Mount: Surface Mount; Packaging: Tape and Reel; Height: 0.04inch; Length: 0.119inch; Contact Plating: Tin; Lead Free: Lead Free; Drain to Source Breakdown Voltage: 20V; Max Dual Supply Voltage: 20V; Number of Pins: 3; Halogen Free: Halogen Free; Max Operating Temperature: 150°C; Case/Package: SOT-23; Min Operating Temperature: -55°C; Width: 0.055inch
R1 R13 R15 R16 = RMCF0603FT1K00: RES 1K OHM 1% 1/10W 0603; Supplier 1: Digi-Key; Supplier Part Number 1: 541-4.7KSACT-ND
R2 = RMCF0603FT261R: RES 261 OHM 1% 1/10W 0603; Supplier 1: Digi-Key; Supplier Part Number 1: 541-4.7KSACT-ND
R3 R6 R19 R21 R28-R30 R32 = RMCF0603FT10K0: RES 10K OHM 1% 1/10W 0603; Supplier 1: Digi-Key; Supplier Part Number 1: 541-4.7KSACT-ND
R4 R8 R10-R12 R14 R31 = RMCF0603FT100R: RES 100 OHM 1% 1/10W 0603; Supplier 1: Digi-Key; Supplier Part Number 1: 541-4.7KSACT-ND
R5 = RMCF0603FT5K23: RES 5.23K OHM 1% 1/10W 0603; Supplier 1: Digi-Key; Supplier Part Number 1: 541-4.7KSACT-ND
R7 = RMCF0603FG30K1: RES 30.1K OHM 1% 1/10W 0603; Supplier 1: Digi-Key; Supplier Part Number 1: 541-4.7KSACT-ND
R9 R23 R26 = RMCF0603FT100K: RES 100K OHM 1% 1/10W 0603; Supplier 1: Digi-Key; Supplier Part Number 1: 541-4.7KSACT-ND
R17 R18 = RMCF0603FT47K0: RES 47K OHM 1% 1/10W 0603; Supplier 1: Digi-Key; Supplier Part Number 1: 541-4.7KSACT-ND
R20 R25 R27 = RMCF0603FT300R: RES 300 OHM 1% 1/10W 0603; Supplier 1: Digi-Key; Supplier Part Number 1: 541-4.7KSACT-ND
R22 = R0603_13: RES 17 OHM 1% 1/10W 0603; Supplier 1: Digi-Key; Supplier Part Number 1: 541-4.7KSACT-ND
R24 = RMCF0603FT4K70: RES 4.7K OHM 1% 1/10W 0603; Supplier 1: Digi-Key; Supplier Part Number 1: 541-4.7KSACT-ND
R?#1-R?#4 = RMCF0603FT1K00: RES 18K OHM 1% 1/10W 0603; Supplier 1: Digi-Key; Supplier Part Number 1: 541-4.7KSACT-ND
SW1-SW3 SW?#1-SW?#4 = FSMSM: SWITCH TACTILE SPST-NO 0.05A 24V; Manufacturer: TE Connectivity; Manufacturer Part Number: FSMSMTR; Electrical Life: 20000Cycles; Operating Force: 180gf; Switch Travel: 0.25mm; Contact Current Rating: 50mA; Case\/Package: SMD/SMT; Actuator Length: 1.07mm; Throw Configuration: SPST; Actuator Material: Polyamide; Contact Resistance: 100mOhm; Illumination Type: Illuminated; Max Voltage Rating (DC): 12V; Voltage Rating (DC): 24V; Manufacturer URL: http://www.te.com/; Lead Free: LeadFree; Packaging: TapeandReel; Min Operating Temperature: -35degC; Mechanical Life: 20000Cycles; Mount: SurfaceMount; REACH SVHC: Unknown; Package Quantity: 1800; Package Reference: FSMSMTR; RoHSCompliant: true; Max Operating Temperature: 85degC; Orientation: Straight; ELV: Compliant; Datasheet URL: http://www.te.com/commerce/DocumentDelivery/DDEController?Action=showdoc&DocId=Customer+Drawing%7F1437566-3%7FC2%7Fpdf%7FEnglish%7FENG_CD_1437566-3_C2_1437566_3_1_c.dwg.pdf%7F1437566-4; Package Description: 2-Pin Surface Mount Device, Body 6 x 3.5 mm, Pitch 9.19 mm; Current Rating: 50mA; Contact Plating: Silver; Termination: GullWing; Datasheet Version: Rev. C2, 08/2014; Contact Material: Brass; Mounting Technology: SurfaceMount
T1-T6 = Test_point: Test point (DNP)
U1 = AP2112K-3.3TRG1: IC REG LINEAR 3.3V 600MA SOT25; Manufacturer: Diodes; Number of Regulators: 1; Output Type: Fixed; Polarity: Positive; Min Input Voltage: 2.5V; Max Input Voltage: 6V; Accuracy: 1.5%; Quiescent Current: 55uA; Dropout Voltage: 250mV; Min Operating Temperature: -40°C; Length: 3.1mm; Output Current: 600mA; Max Operating Temperature: 85°C; Package Quantity: 1; Output Voltage: 3.3V; Width: 1.7mm; Number of Outputs: 1; Packaging: Tape and Reel; Height: 1.3mm; Lead Free: Lead Free; Max Output Current: 600mA; Case/Package: SOT-23-5; Mount: Surface Mount; Number of Pins: 5; Manufacturer Part Number: AP2112K-3.3TRG1
U2 = BQ25895MRTWR: IC BATT CHG LI-ION 1CELL 24WQFN; Manufacturer: Texas Instruments; Max Charge Current: 5A; Output Voltage: 5.5V; Interface: I2C; Number of Cells: 1; Fault Protection: Over Temperature; Max Supply Voltage: 14V; Max Operating Temperature: 85°C; Mount: Surface Mount; Contact Plating: Gold; Min Operating Temperature: -40°C; Output Current: 5A; RoHS Compliant: Yes; Lead Free: Lead Free; Packaging: Cut Tape; Number of Pins: 24; Manufacturer Part Number: BQ25895MRTWR
U3 = TS3USB221DRCR: IC USB SWITCH DUAL 1X2 10SON; Manufacturer: Texas Instruments; Number of Channels: 2; ON Time(Max)(ns): 30; RON Mis-match(Max)(Ohms): 0.2; Vcc range(V): 2.3 to 3.6; tpd max(ns): 0.25; OFF Time(Max)(ns): 12; ron(max)(ohms): 6; ESD HBM(kV): +/-2; Architecture: "1","2 mux/demux"; Eco-Plan: Green (RoHS & no Sb/Br); RON Flatness(Max)(Ohms): 1; Bandwidth(MHz): 1200; IL OFF(Max)(nA): 2; SubFamily: USB Switch; PackageVersion: revL, Sep-2011; Mounting Technology: Surface Mount; ICC(uA): 30; DatasheetVersion: SCDS220G; PartNumber: TS3USB221DRCR; Charge Injection(Max)(pC): N/A; ComponentLink1Description: Datasheet; PackageDescription: 10-Pin Plastic Small Outline No-Lead, 3 x 3 x 1 mm Body, 0.5 mm Pitch, Exposed Pad; ComponentLink2URL: http://www.ti.com/litv/pdf/mpds117k; ComponentLink2Description: Package Specification; ComponentLink1URL: http://www.ti.com/general/docs/lit/getliterature.tsp?genericPartNumber=TS3USB221&fileType=pdf; PackageReference: DRC0010J; Manufacturer Part Number: TS3USB221DRCR
U4 = Y31N: Sensor Module Inclinometer; Manufacturer: EQV; Number of Regulators: 1; Output Current: 600mA; Output Type: Fixed; Polarity: Positive; Min Input Voltage: 2.5V; Output Voltage: 3.3V; Max Input Voltage: 6V; Accuracy: 1.5%; Quiescent Current: 55uA; Dropout Voltage: 250mV; Min Operating Temperature: -40°C; Length: 3.1mm; Max Operating Temperature: 85°C; Package Quantity: 1; Width: 1.7mm; Number of Outputs: 1; Packaging: Tape and Reel; Height: 1.3mm; Lead Free: Lead Free; Max Output Current: 600mA; Case/Package: SOT-23-5; Mount: Surface Mount; Number of Pins: 5
U5 = SN65HVD3082EDR: IC TRANSCEIVER HALF 1/1 8SOIC; Manufacturer: Texas Instruments; Data Rate: 0.2Mbits/s; Standoff Height: 0.11mm; Max Junction Temp: +130°C; Number Of Transmitters: 1; Nominal Supply Current: 300-425uA; Min Supply Voltage: 4.5V; Simplex Duplex: Half Duplex; Max Supply Voltage: 5.5V; Interface: RS-485,RS-422; Lead Free: Yes; Temperature Range High: +85°C; Ambient Temperature Range High: +105°C; Octopart: https://octopart.com/sn65hvd3082edr-texas+instruments-712058; Automotive: No; Ambient Temperature Range Low: -40°C; RoHS: TRUE; Device Class L2: Interface ICs; Mouser Description: RS-485 Interface IC Low-Power RS-485 Transceiver; Package: D0008A; Digikey Description: IC TRANSCEIVER HALF 1/1 8SOIC; Device Class L1: Integrated Circuits (ICs); Height: 1.75mm; ComponentLink2Description: Datasheet; Category: IC; Temperature Range Low: -40°C; Number Of Receivers: 1; Device Class L3: RS-232 / RS-422 / RS-485 Interface ICs; Ipc Land Pattern Name: SOIC127P600X175-8; ComponentLink2URL: http://www.ti.com/lit/ds/symlink/sn65hvd3082e.pdf; Temperature: -40°C to +85°C; Manufacturer Part Number: SN65HVD3082EDR
U6 = EG915NEUAC-N06-SNNSA: Linear IC; MF: Quectel; MP: EG915NEUAC-N06-SNNSA; Package: NON-STANDARD-126 Quectel; Availability: In Stock; Value: *; Price: None; Check_prices: https://www.snapeda.com/parts/EG915NEUAC-N06-SNNSA/Quectel/view-part/?ref=eda; SnapEDA_Link: https://www.snapeda.com/parts/EG915NEUAC-N06-SNNSA/Quectel/view-part/?ref=snap
U7 = W25Q32BVSSIG: IC FLASH 32MBIT SPI/QUAD 8SOIC; MF: Winbond Electronics; Availability: Unavailable; SnapEDA_Link: https://www.snapeda.com/parts/W25Q32BVSSIG/Winbond%20Electronics/view-part/552390/?ref=snap; MP: W25Q32BVSSIG; Price: None; Value: *; Package: SOIC-8 Winbond
U8 = LD56100DPU33R: IC REG LINEAR 3.3V 1A 8DFN; Manufacturer_Name: STMicroelectronics; Geometry.Height: 1mm; Mouser Part Number: 511-LD56100DPU33R; Mouser Price/Stock: https://www.mouser.co.uk/ProductDetail/STMicroelectronics/LD56100DPU33R?qs=lYGu3FyN48ervycZizbDLw%3D%3D; Manufacturer_Part_Number: LD56100DPU33R; Datasheet Link: https://componentsearchengine.com/Datasheets/1/LD56100DPU33R.pdf
U9 = USBLC6-2SC6: TVS DIODE 5.25VWM 17VC SOT23-6; MF: STMicroelectronics; Value: *; SnapEDA_Link: https://www.snapeda.com/parts/USBLC6-2SC6/STMicroelectronics/view-part/?ref=snap; Check_prices: https://www.snapeda.com/parts/USBLC6-2SC6/STMicroelectronics/view-part/?ref=eda; Purchase-URL: https://pricing.snapeda.com/search/part/USBLC6-2SC6/?ref=eda; Price: None; Availability: In Stock; Package: SOT-23-6 STMicroelectronics; MP: USBLC6-2SC6
U10 = ZED-F9P-02B: MOD RF RECEIVER GNSS 54LGA; Manufacturer_Name: U-Blox; Geometry.Height: 2.6mm; Manufacturer_Part_Number: ZED-F9P-02B; Mouser Part Number: 377-ZED-F9P-02B; Mouser Price/Stock: https://www.mouser.co.uk/ProductDetail/u-blox/ZED-F9P-02B?qs=DPoM0jnrROVJit2O2Grdqw%3D%3D; Arrow Part Number: *; Arrow Price/Stock: *; Datasheet Link: https://www.u-blox.com/sites/default/files/ZED-F9P_DataSheet_%28UBX-17051259%29.pdf
U11 = DEA162450BT-1260B2: RF FILTER BAND PASS 2.45GHZ 0603; MP: DEA162450BT-1288B1; Package: None; Price: None; Value: *; Availability: Unavailable
U12 = STM32WB55RCV6: ULTRA-LOW-POWER DUAL CORE ARM CO; Manufacturer_Name: STMicroelectronics; Geometry.Height: 1mm; Manufacturer_Part_Number: STM32WB55RCV6; Mouser Part Number: 511-STM32WB55RCV6; Mouser Price/Stock: https://www.mouser.co.uk/ProductDetail/STMicroelectronics/STM32WB55RCV6?qs=vLWxofP3U2y%2F21YKkPUpfQ%3D%3D; Arrow Part Number: STM32WB55RCV6; Arrow Price/Stock: https://www.arrow.com/en/products/stm32wb55rcv6/stmicroelectronics?region=nac; Datasheet Link: https://www.mouser.com/datasheet/2/389/stm32wb55rc-1588898.pdf
Y1 Y2 = ECS-120-8-36-CKM-TR3: CRYSTAL 12.0000MHZ 8PF SMD; Supplier 1: Digi-Key; Supplier Part Number 1: 535-9116-1-ND